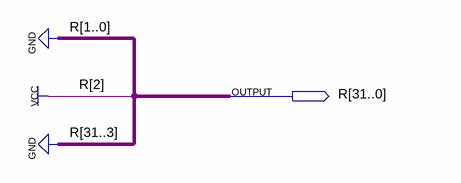
[diagram p0: schematic sheet]
// Quartus schematic QUATRO.bdf as structural Verilog: 0 symbols, 1 pins
module QUATRO (
  output [31:0] R
);


  assign R = 32'b00000000000000000000000000000100;
endmodule
